# Altium schematic sheet mux_stack_espE.SchDoc
size 420 x 297 mm; SheetNumber: 1; SheetTotal: 1
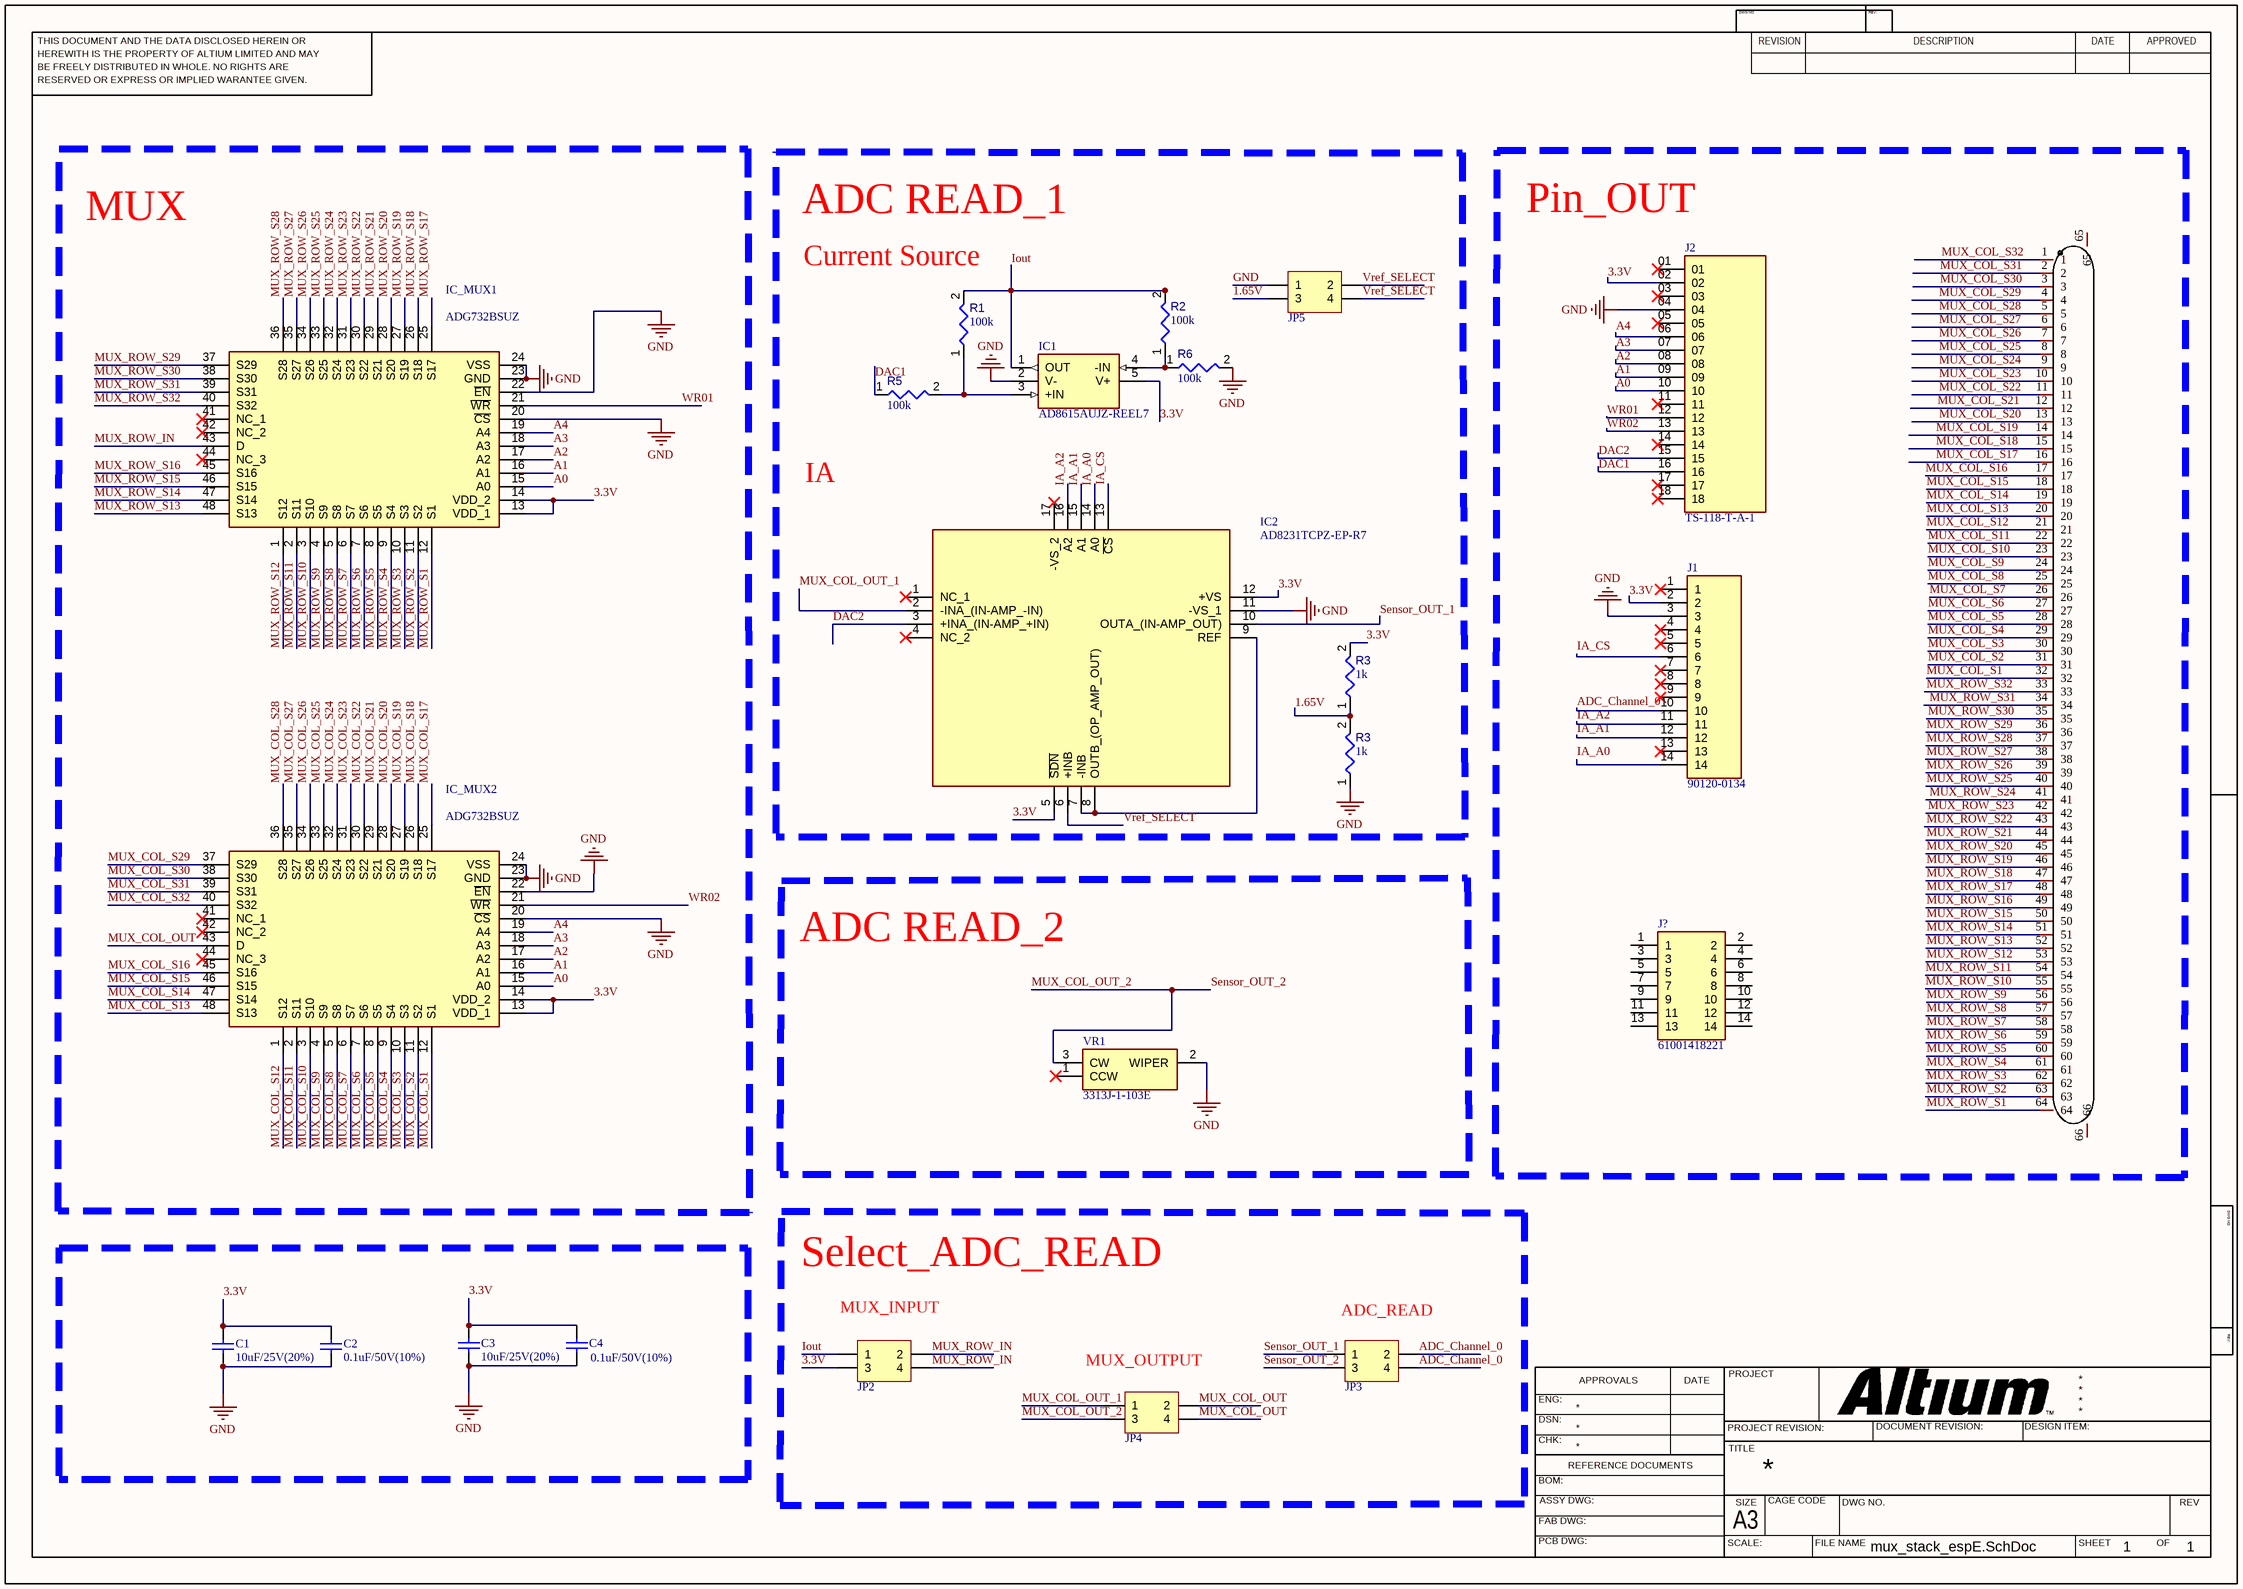
[diagram p0: mux_stack_espE.SchDoc]

## Parts
(Parts that share a designator on the sheet are numbered #1, #2 ... from top to bottom, then left to right.)
C1  10uF/25V(20%)  [C0603_M]
C2  0.1uF/50V(10%)  [C0603_M]
C3  10uF/25V(20%)  [C0603_M]
C4  0.1uF/50V(10%)  [C0603_M]
FPC1  8.15A0.064200  [PCBComponent_1]  (value not drawn)
IC1  AD8615AUJZ-REEL7  [SOT95P280X100-5N]
IC2  AD8231TCPZ-EP-R7  [QFN65P400X400X80-17N-D]
IC_MUX1  ADG732BSUZ  [QFP50P900X900X120-48N]
IC_MUX2  ADG732BSUZ  [QFP50P900X900X120-48N]
J1  90120-0134  [HDRV14W65P0X254_1X14_3534X249X560P]
J2  TS-118-T-A-1  [SAMTEC_TS-118-T-A-1]
J?  61001418221  [61001418221]
JP2  Header2X2  [HDR2.54-LI-2x2P]  (value not drawn)
JP3  Header2X2  [HDR2.54-LI-2x2P]  (value not drawn)
JP4  Header2X2  [HDR2.54-LI-2x2P]  (value not drawn)
JP5  Header2X2  [HDR2.54-LI-2x2P]  (value not drawn)
R1  value 100k  [RESC1608X55X25ML10T15]  (hidden comment: Resistor 100k +/-1% 0603 100 mW)
R2  value 100k  [RESC1608X55X25ML10T15]  (hidden comment: Resistor 100k +/-1% 0603 100 mW)
R3#1  value 1k  [RESC1608X55X25ML10T15]  (hidden comment: Resistor 1k +/-1% 0603 100 mW)
R3#2  value 1k  [RESC1608X55X25ML10T15]  (hidden comment: Resistor 1k +/-1% 0603 100 mW)
R5  value 100k  [RESC1608X55X25ML10T15]  (hidden comment: Resistor 100k +/-1% 0603 100 mW)
R6  value 100k  [RESC1608X55X25ML10T15]  (hidden comment: Resistor 100k +/-1% 0603 100 mW)
VR1  3313J-1-103E  [3313J1103E]

## Blocks framed on the sheet
MUX: IC_MUX1 IC_MUX2
Pin_OUT: FPC1 J1 J2 J?

## Nets
GND: C1.1 C2.1 C3.1 C4.1 IC1.2(V-) IC2.11(-VS_1) IC_MUX1.20(~{CS}) IC_MUX1.22(~{EN}) IC_MUX1.23(GND) IC_MUX1.24(VSS) IC_MUX2.20(~{CS}) IC_MUX2.22(~{EN}) IC_MUX2.23(GND) IC_MUX2.24(VSS) J1.3 J2.04 JP5.1 R3#2.1 R6.2 VR1.2(WIPER)
1.65V: JP5.3 R3#1.1 R3#2.2
3.3V: C1.2 C2.2 C3.2 C4.2 IC1.5(V+) IC2.5(~{SDN}) IC2.12(+VS) IC_MUX1.13(VDD_1) IC_MUX1.14(VDD_2) IC_MUX2.13(VDD_1) IC_MUX2.14(VDD_2) J1.2 J2.02 JP2.3 R3#1.2
A0: IC_MUX1.15(A0) IC_MUX2.15(A0) J2.10
A1: IC_MUX1.16(A1) IC_MUX2.16(A1) J2.09
A2: IC_MUX1.17(A2) IC_MUX2.17(A2) J2.08
A3: IC_MUX1.18(A3) IC_MUX2.18(A3) J2.07
A4: IC_MUX1.19(A4) IC_MUX2.19(A4) J2.06
ADC_Channel_0: J1.10 JP3.2 JP3.4
DAC1: J2.16 R5.1
DAC2: IC2.3(+INA_(IN-AMP_+IN)) J2.15
IA_A0: IC2.14(A0) J1.14
IA_A1: IC2.15(A1) J1.12
IA_A2: IC2.16(A2) J1.11
IA_CS: IC2.13(~{CS}) J1.6
Iout: IC1.1(OUT) JP2.1 R1.2 R2.2
MUX_COL_OUT: IC_MUX2.43(D) JP4.2 JP4.4
MUX_COL_OUT_1: IC2.2(-INA_(IN-AMP_-IN)) JP4.1
MUX_COL_OUT_2: JP3.3 JP4.3 VR1.3(CW)  [also labelled Sensor_OUT_2]
MUX_COL_S1: FPC1.32 IC_MUX2.12(S1)
MUX_COL_S2: FPC1.31 IC_MUX2.11(S2)
MUX_COL_S3: FPC1.30 IC_MUX2.10(S3)
MUX_COL_S4: FPC1.29 IC_MUX2.9(S4)
MUX_COL_S5: FPC1.28 IC_MUX2.8(S5)
MUX_COL_S6: FPC1.27 IC_MUX2.7(S6)
MUX_COL_S7: FPC1.26 IC_MUX2.6(S7)
MUX_COL_S8: FPC1.25 IC_MUX2.5(S8)
MUX_COL_S9: FPC1.24 IC_MUX2.4(S9)
MUX_COL_S10: FPC1.23 IC_MUX2.3(S10)
MUX_COL_S11: FPC1.22 IC_MUX2.2(S11)
MUX_COL_S12: FPC1.21 IC_MUX2.1(S12)
MUX_COL_S13: FPC1.20 IC_MUX2.48(S13)
MUX_COL_S14: FPC1.19 IC_MUX2.47(S14)
MUX_COL_S15: FPC1.18 IC_MUX2.46(S15)
MUX_COL_S16: FPC1.17 IC_MUX2.45(S16)
MUX_COL_S17: FPC1.16 IC_MUX2.25(S17)
MUX_COL_S18: FPC1.15 IC_MUX2.26(S18)
MUX_COL_S19: FPC1.14 IC_MUX2.27(S19)
MUX_COL_S20: FPC1.13 IC_MUX2.28(S20)
MUX_COL_S21: FPC1.12 IC_MUX2.29(S21)
MUX_COL_S22: FPC1.11 IC_MUX2.30(S22)
MUX_COL_S23: FPC1.10 IC_MUX2.31(S23)
MUX_COL_S24: FPC1.9 IC_MUX2.32(S24)
MUX_COL_S25: FPC1.8 IC_MUX2.33(S25)
MUX_COL_S26: FPC1.7 IC_MUX2.34(S26)
MUX_COL_S27: FPC1.6 IC_MUX2.35(S27)
MUX_COL_S28: FPC1.5 IC_MUX2.36(S28)
MUX_COL_S29: FPC1.4 IC_MUX2.37(S29)
MUX_COL_S30: FPC1.3 IC_MUX2.38(S30)
MUX_COL_S31: FPC1.2 IC_MUX2.39(S31)
MUX_COL_S32: FPC1.1 IC_MUX2.40(S32)
MUX_ROW_IN: IC_MUX1.43(D) JP2.2 JP2.4
MUX_ROW_S1: FPC1.64 IC_MUX1.12(S1)
MUX_ROW_S2: FPC1.63 IC_MUX1.11(S2)
MUX_ROW_S3: FPC1.62 IC_MUX1.10(S3)
MUX_ROW_S4: FPC1.61 IC_MUX1.9(S4)
MUX_ROW_S5: FPC1.60 IC_MUX1.8(S5)
MUX_ROW_S6: FPC1.59 IC_MUX1.7(S6)
MUX_ROW_S7: FPC1.58 IC_MUX1.6(S7)
MUX_ROW_S8: FPC1.57 IC_MUX1.5(S8)
MUX_ROW_S9: FPC1.56 IC_MUX1.4(S9)
MUX_ROW_S10: FPC1.55 IC_MUX1.3(S10)
MUX_ROW_S11: FPC1.54 IC_MUX1.2(S11)
MUX_ROW_S12: FPC1.53 IC_MUX1.1(S12)
MUX_ROW_S13: FPC1.52 IC_MUX1.48(S13)
MUX_ROW_S14: FPC1.51 IC_MUX1.47(S14)
MUX_ROW_S15: FPC1.50 IC_MUX1.46(S15)
MUX_ROW_S16: FPC1.49 IC_MUX1.45(S16)
MUX_ROW_S17: FPC1.48 IC_MUX1.25(S17)
MUX_ROW_S18: FPC1.47 IC_MUX1.26(S18)
MUX_ROW_S19: FPC1.46 IC_MUX1.27(S19)
MUX_ROW_S20: FPC1.45 IC_MUX1.28(S20)
MUX_ROW_S21: FPC1.44 IC_MUX1.29(S21)
MUX_ROW_S22: FPC1.43 IC_MUX1.30(S22)
MUX_ROW_S23: FPC1.42 IC_MUX1.31(S23)
MUX_ROW_S24: FPC1.41 IC_MUX1.32(S24)
MUX_ROW_S25: FPC1.40 IC_MUX1.33(S25)
MUX_ROW_S26: FPC1.39 IC_MUX1.34(S26)
MUX_ROW_S27: FPC1.38 IC_MUX1.35(S27)
MUX_ROW_S28: FPC1.37 IC_MUX1.36(S28)
MUX_ROW_S29: FPC1.36 IC_MUX1.37(S29)
MUX_ROW_S30: FPC1.35 IC_MUX1.38(S30)
MUX_ROW_S31: FPC1.34 IC_MUX1.39(S31)
MUX_ROW_S32: FPC1.33 IC_MUX1.40(S32)
Sensor_OUT_1: IC2.10(OUTA_(IN-AMP_OUT)) JP3.1
Vref_SELECT: IC2.6(+INB) JP5.2 JP5.4
WR01: IC_MUX1.21(~{WR}) J2.12
WR02: IC_MUX2.21(~{WR}) J2.13
NetIC1_3: IC1.3(+IN) R1.1 R5.2
NetIC1_4: IC1.4(-IN) R2.1 R6.1
NetIC2_7: IC2.7(-INB) IC2.8(OUTB_(OP_AMP_OUT)) IC2.9(REF)

Not connected (* = marked no-connect by the designer): FPC1 65 66; IC2 1(NC_1)* 4(NC_2)* 17(-VS_2)*; IC_MUX1 41(NC_1)* 42(NC_2)* 44(NC_3)*; IC_MUX2 41(NC_1)* 42(NC_2)* 44(NC_3)*; J1 1* 4* 5* 7* 8* 9* 13*; J2 01* 03* 05* 11* 14* 17* 18*; J? 1 2 3 4 5 6 7 8 9 10 11 12 13 14; VR1 1(CCW)*

## Notes on the sheet
- ADC READ_1
- (near R1) Current Source
- IA
- ADC READ_2
- Select_ADC_READ
- (near JP2) MUX_INPUT
- (near JP3) ADC_READ
- (near JP4) MUX_OUTPUT
- THIS DOCUMENT AND THE DATA DISCLOSED HEREIN OR
- HEREWITH IS THE PROPERTY OF ALTIUM LIMITED AND MAY
- DWG NO:
- REVISION
- REV:
- DESCRIPTION
- DATE
- APPROVED
- BE FREELY DISTRIBUTED IN WHOLE. NO RIGHTS ARE
- RESERVED OR EXPRESS OR IMPLIED WARANTEE GIVEN.
- ENG:
- APPROVALS
- PROJECT
- DSN:
- CHK:
- REFERENCE DOCUMENTS
- PROJECT REVISION:
- TITLE
- DOCUMENT REVISION:
- DESIGN ITEM:
- BOM:
- FAB DWG:
- PCB DWG:
- ASSY DWG:
- SCALE:
- A3
- SIZE
- CAGE CODE
- FILE NAME
- DWG NO.
- SHEET
- OF
- REV

## Library data of the parts
C1-C4 = C: 贴片电容/MLCC电容; BOM名称: 无极性贴片电容; 联系下单店铺卖家 免费帮你查找封装: 联系下单店铺卖家 免费技术指导; 当前库版本V2024.2.3 @淘宝卖家:黄晶宝石: 最新版本发布https://item.taobao.com/item.htm?id=566775463719
FPC1 = 8.15A0.064200: Manufacturer: DIANWEI(钿威科技); Add into BOM: yes; Locking Feature: Clamshell; Number of Contacts: 64P; Pitch: 0.5mm; Symbol: 8.15A0.064200; Device: 8.15A0.064200; LCSC Part Name: 翻盖式 下接 P数:64P 间距:0.5mm; Supplier Part: C20626047; Manufacturer Part: 8.15A0.064200; Supplier Footprint: SMD,P=0.5mm,卧贴; JLCPCB Part Class: Extended Part; Datasheet: https://atta.szlcsc.com/upload/public/pdf/source/20240226/9B0E964ABAD9EBDCC7FF6472C3CD9B36.pdf; Supplier: LCSC; Convert to PCB: yes; Contact Type: Bottom Contact; Height Above Board: 1.8mm; Contact Plating: Gold
IC1 = AD8615AUJZ-REEL7: Integrated Circuit; Manufacturer_Name: Analog Devices; Datasheet Link: http://www.farnell.com/datasheets/1841629.pdf; Height: 1mm; Manufacturer_Part_Number: AD8615AUJZ-REEL7; Mouser Part Number: 584-AD8615AUJZ-R7; Mouser Price/Stock: https://www.mouser.co.uk/ProductDetail/Analog-Devices/AD8615AUJZ-REEL7?qs=%2FtpEQrCGXCyHRrprFEn%2Fog%3D%3D; Arrow Part Number: AD8615AUJZ-REEL7; Arrow Price/Stock: https://www.arrow.com/en/products/ad8615aujz-reel7/analog-devices?utm_currency=USD&region=europe
IC2 = AD8231TCPZ-EP-R7: Integrated Circuit; Manufacturer_Name: Analog Devices; Datasheet Link: https://www.analog.com/media/en/technical-documentation/data-sheets/AD8231-EP.pdf; Height: 0.8mm; Manufacturer_Part_Number: AD8231TCPZ-EP-R7; Mouser Part Number: 584-AD8231TCPZ-EP-R7; Mouser Price/Stock: https://www.mouser.co.uk/ProductDetail/Analog-Devices/AD8231TCPZ-EP-R7?qs=%2FtpEQrCGXCwVvPTzyZftPQ%3D%3D; Arrow Part Number: AD8231TCPZ-EP-R7; Arrow Price/Stock: https://www.arrow.com/en/products/ad8231tcpz-ep-r7/analog-devices?region=nac
IC_MUX1 IC_MUX2 = ADG732BSUZ: Integrated Circuit; Manufacturer_Name: Analog Devices; Datasheet Link: https://datasheet.datasheetarchive.com/originals/distributors/Datasheets-4/DSA-69835.pdf; Height: 1.2mm; Manufacturer_Part_Number: ADG732BSUZ; Mouser Part Number: 584-ADG732BSUZ; Mouser Price/Stock: https://www.mouser.co.uk/ProductDetail/Analog-Devices/ADG732BSUZ?qs=BpaRKvA4VqFZhnJK9M1XMA%3D%3D; Arrow Part Number: ADG732BSUZ; Arrow Price/Stock: https://www.arrow.com/en/products/adg732bsuz/analog-devices?region=europe
J1 = 90120-0134: Connector; Manufacturer_Name: Molex; Datasheet Link: https://4donline.ihs.com/images/VipMasterIC/IC/MOLE/MOLE-S-A0008996596/MOLE-S-A0008996596-1.pdf?hkey=EF798316E3902B6ED9A73243A3159BB0; Height: 5.6mm; Manufacturer_Part_Number: 90120-0134
J2 = CMP-002-00076-1: HEADER, 2.54MM, THOUGH HOLE VERTICAL, 18 POSITION; Connector Systems:Board-to-Board; Pitch Spacing:2.54mm; No. of Rows:1Rows; No. of Contacts:18Contacts; Contact Termination Type:Through Hole; Product Range:TS Series; Gender:Header RoHS Compliant: Yes; MF: Samtec; Source: TS-118-T-A-1.SchLib; MP: TS-118-T-A-1; Purchase-URL: https://pricing.snapeda.com/search/part/TS-118-T-A-1/?ref=eda; Pins: 18; SnapEDA_Link: https://www.snapeda.com/parts/TS-118-T-A-1/Samtec/view-part/?ref=snap; Case/Package: None; Check_prices: https://www.snapeda.com/parts/TS-118-T-A-1/Samtec/view-part/?ref=eda; Component Type: Standard; Design Item ID: TS-118-T-A-1; Value: *; Availability: In Stock; Price: None
J? = 61001418221: Connector; Manufacturer_Name: Wurth Elektronik; Datasheet Link: https://componentsearchengine.com/Datasheets/1/61001418221.pdf; Height: 9.3mm; Manufacturer_Part_Number: 61001418221; Mouser Part Number: 710-61001418221; Mouser Price/Stock: https://www.mouser.co.uk/ProductDetail/Wurth-Elektronik/61001418221?qs=PhR8RmCirEZbaE9NVx%2FAsQ%3D%3D
JP2-JP5 = Header 2X2: 2*2P接插件; 版权归属: 封装库来自淘宝 ID：黄晶宝石; BOM名称: 2*2P接插件
R1 R2 R5 R6 = CMP-009-00023-5: Chip Resistor, 100 KOhm, +/- 1%, 0.1 W, -55 to 155 degC, 0603 (1608 Metric); Voltage Rating: 50V; Power: 100mW; Max Operating Temperature: 155°C; RoHS Compliant: True; Tolerance: 1%; Pins: 2; Case/Package: 0603; Mounting Technology: SM; Min Operating Temperature: -55°C
R3#1 R3#2 = CMP-009-00014-5: Chip Resistor, 1 KOhm, +/-1%, 0.1 W, -55 to 155 degC, 0603 (1608 Metric); Voltage Rating: 50V; Power: 100mW; Tolerance: 1%; Mounting Technology: SM; Pins: 2; Case/Package: 0603; Min Operating Temperature: -55°C; RoHS Compliant: True; Max Operating Temperature: 155°C
VR1 = 3313J-1-103E: Variable Resistor; Manufacturer_Name: Bourns; Datasheet Link: https://www.bourns.com/docs/Product-Datasheets/3313.pdf; Height: 2.4mm; Manufacturer_Part_Number: 3313J-1-103E; Mouser Part Number: 652-3313J-1-103E; Mouser Price/Stock: https://www.mouser.co.uk/ProductDetail/Bourns/3313J-1-103E?qs=oM%2FE6%2FUWOpSJWTaqAX%252Bm%2Fw%3D%3D; Arrow Part Number: 3313J-1-103E; Arrow Price/Stock: https://www.arrow.com/en/products/3313j-1-103e/bourns?region=nac